# Altium project ie-track-kit-pwr-1.PrjPcb
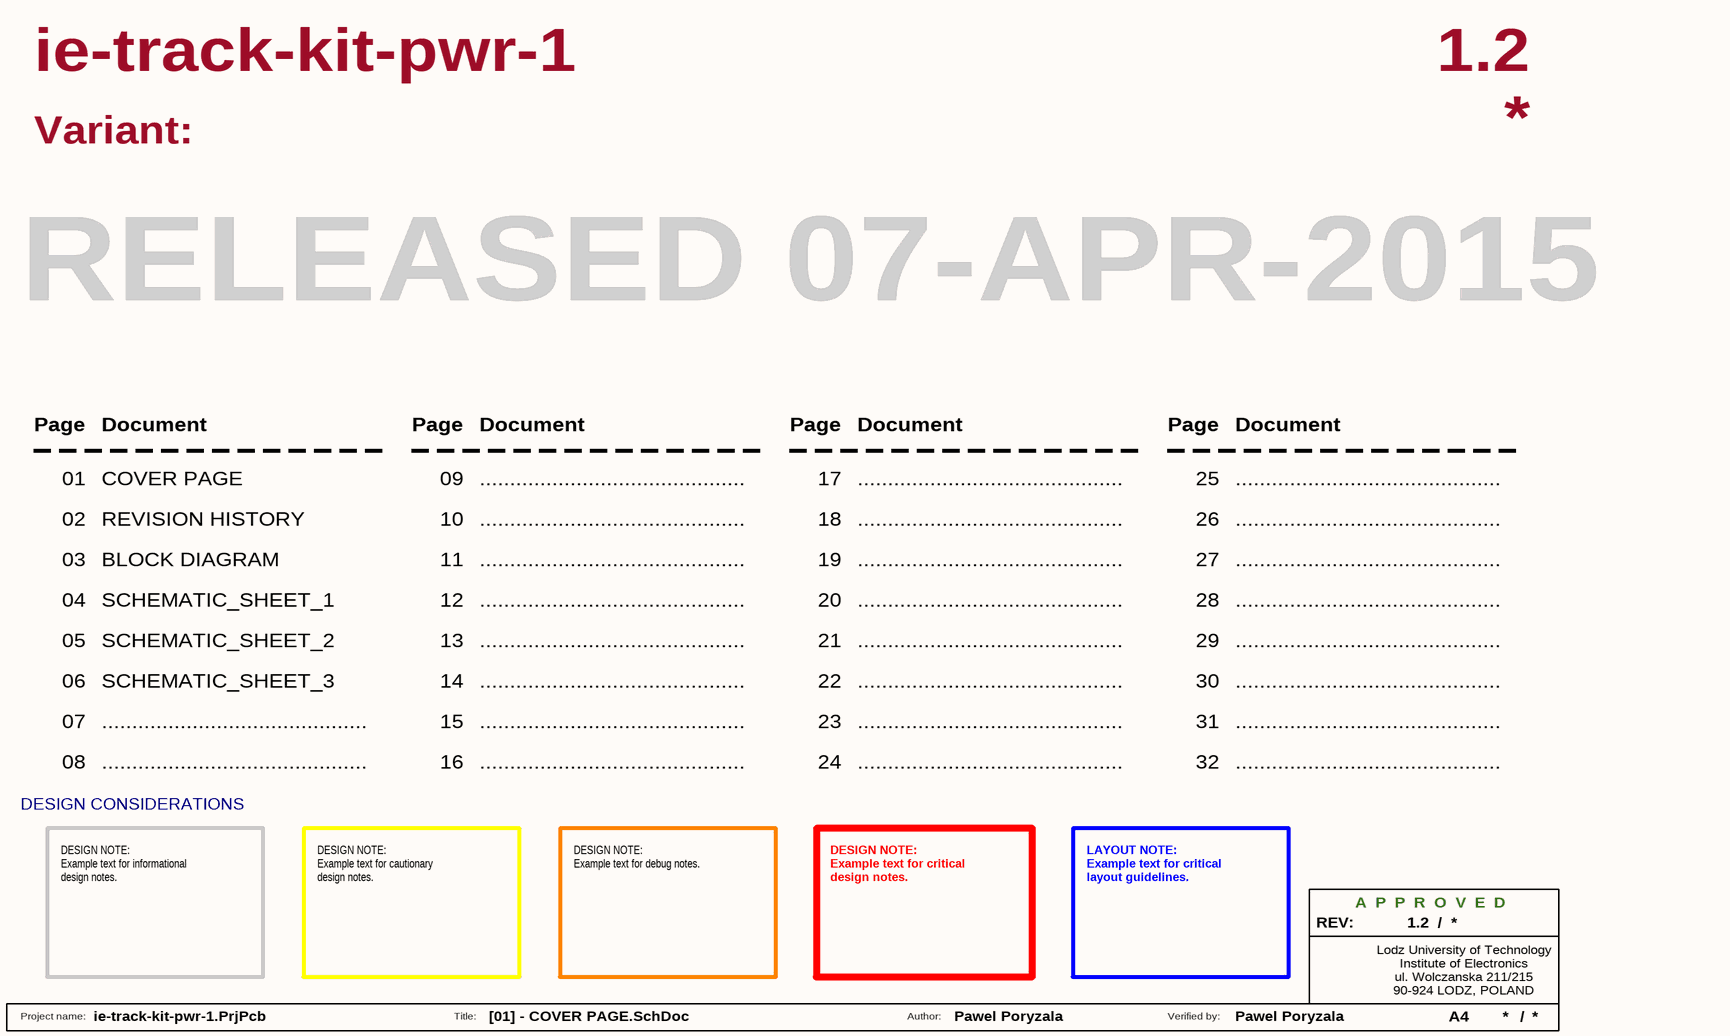
[diagram p0: [01] - COVER PAGE.SchDoc]
ProjectCheckedBy: Pawel Poryzala; ProjectDrawnBy: Pawel Poryzala; ProjectRevision: 1.2; ProjectSheetTotal: 5; ProjectTitle: ie-track-kit-pwr-1
8 sheets, 140 parts. Net scope: global (net labels, ports and power ports of the same name join across sheets).
Board file: ie-track-kit-pwr-1.PcbDoc
Sheets:
  [01] - COVER PAGE.SchDoc
  [02] - REVISION HISTORY.SchDoc
  [03] - BLOCK DIAGRAM.SchDoc
    Designator = [04] - BATTERIES WITH PROTECTION.SchDoc
    Designator = [05] - POWER.SchDoc
    Designator = [06] - MOTOR DRIVERS.SchDoc
    Designator = [07] - LIGHTS.SchDoc
    Designator = [08] - MAIN CONNECTOR.SchDoc

## Sheet [01] - COVER PAGE.SchDoc: Test title
size A4; Projectnumber: OWN-000; Project name:: Test name; Client: DSG; Date: YYYY-MM-DD; CheckedBy: Bartosz Kowierski; DrawnBy: Paweł Poryzała; Engineer: X; Revision: 0.9; Size: A4; Contact: datasystem.pl

### Notes on the sheet
- Variant:
- RELEASED 07-APR-2015
- Page
- Document
- 01
- COVER PAGE
- 09
- ............................................
- 17
- 25
- 02
- 03
- REVISION HISTORY
- BLOCK DIAGRAM
- 10
- 11
- 18
- 19
- 26
- 27
- 04
- 05
- SCHEMATIC_SHEET_1
- SCHEMATIC_SHEET_2
- 12
- 13
- 20
- 21
- 28
- 29
- 06
- SCHEMATIC_SHEET_3
- 14
- 22
- 30
- 07
- 08
- 15
- 16
- 23
- 24
- 31
- 32
- DESIGN CONSIDERATIONS
- DESIGN NOTE:
  Example text for informational
  design notes.
- DESIGN NOTE:
  Example text for cautionary
  design notes.
- DESIGN NOTE:
  Example text for debug notes.
- DESIGN NOTE:
  Example text for critical
  design notes.
- LAYOUT NOTE:
  Example text for critical
  layout guidelines.
- REV:
- A  P  P  R  O  V  E  D
- /
- Lodz University of Technology
- ul. Wolczanska 211/215
- 90-924 LODZ, POLAND
- Institute of Electronics
- Project name:
- Title:
- Author:
- Verified by:

## Sheet [02] - REVISION HISTORY.SchDoc: Test title
size A4; Project name:: Test name; Client: DSG; Date: YYYY-MM-DD; CheckedBy: Bartosz Kowierski; DrawnBy: Paweł Poryzała; Engineer: X; Revision: 0.9; Size: A4; Contact: datasystem.pl
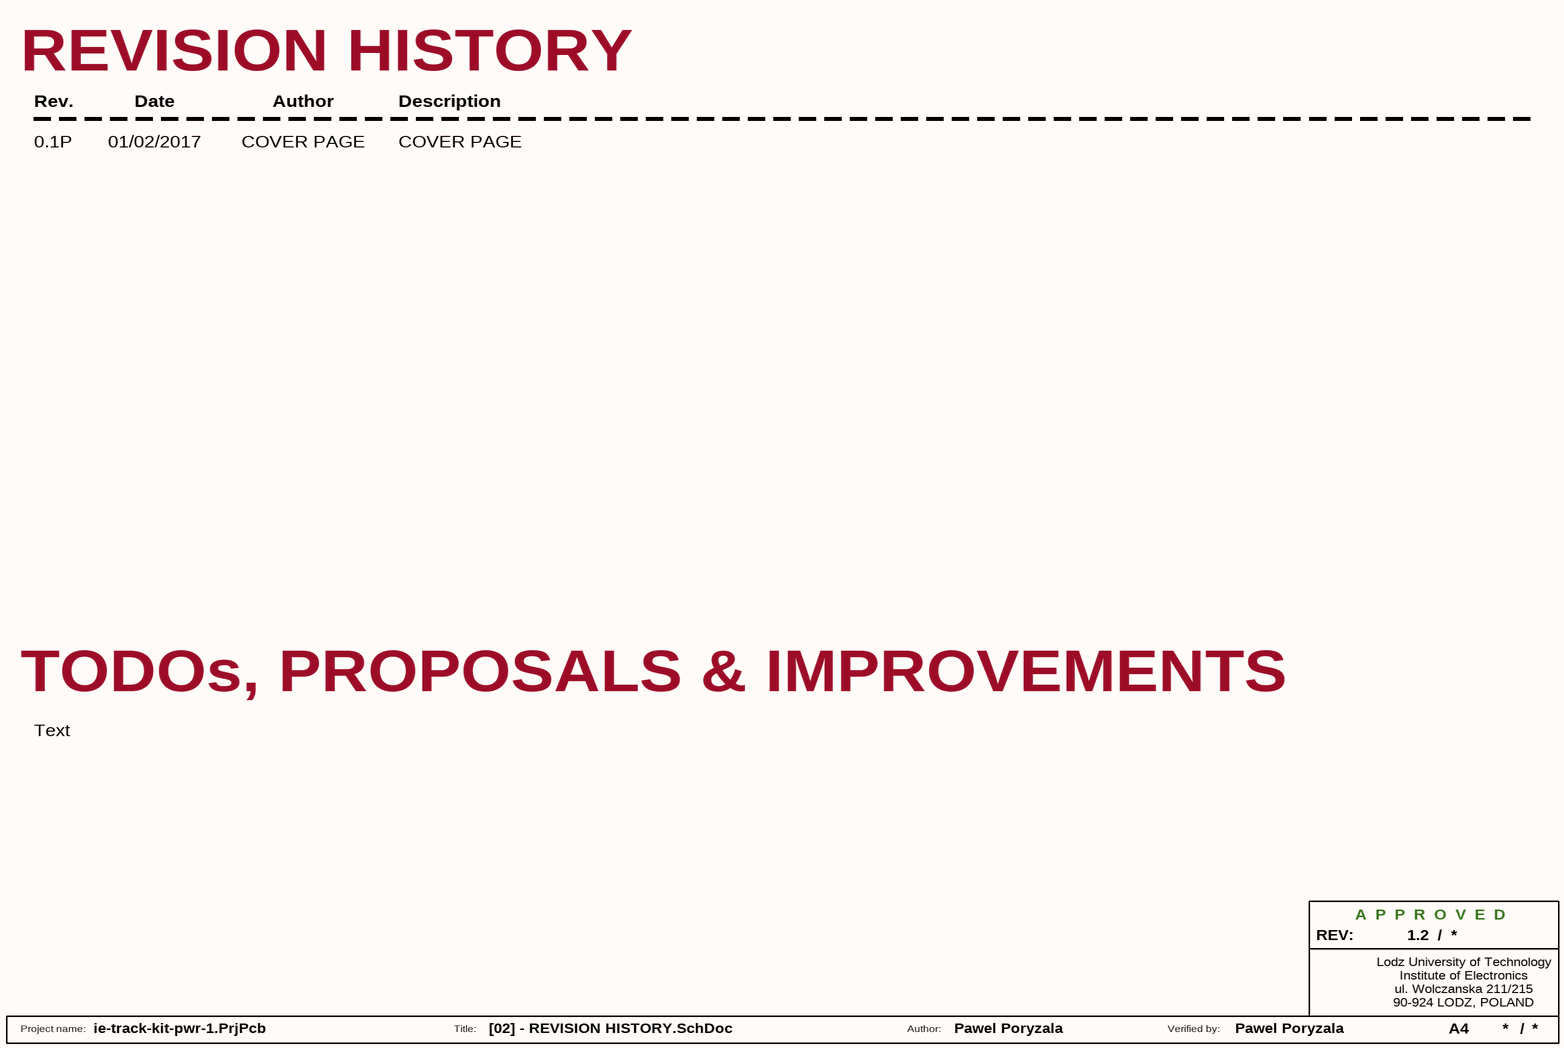
[diagram p1: [02] - REVISION HISTORY.SchDoc]

### Notes on the sheet
- REVISION HISTORY
- Rev.
- Date
- Author
- Description
- 0.1P
- 01/02/2017
- COVER PAGE
- TODOs, PROPOSALS & IMPROVEMENTS
- Text
- REV:
- A  P  P  R  O  V  E  D
- /
- Lodz University of Technology
- ul. Wolczanska 211/215
- 90-924 LODZ, POLAND
- Institute of Electronics
- Project name:
- Title:
- Author:
- Verified by:

## Sheet [03] - BLOCK DIAGRAM.SchDoc: Test title
size A4; PageSetup: Record=PageOptions|CenterHorizontal=True|CenterVertical=True|PrintScale=0.52|XCorrection=1.00|YCorrection=1.00|PrintKind=1|BorderSize=5000000|LeftOffset=0|BottomOffset=0|Orientation=2|PaperLength=1000|PaperWidth=1000|Scale=100|PaperSource=4|PrintQuality=600|MediaType=1|DitherType=10|PrintScaleMode=1|PaperKind=A4|PaperIndex=9; Projectnumber: OWN-000; Project name:: Test name; Client: DSG; Date: YYYY-MM-DD; CheckedBy: Bartosz Kowierski; DrawnBy: Paweł Poryzała; Engineer: X; Revision: 0.9; Size: A4; Contact: datasystem.pl
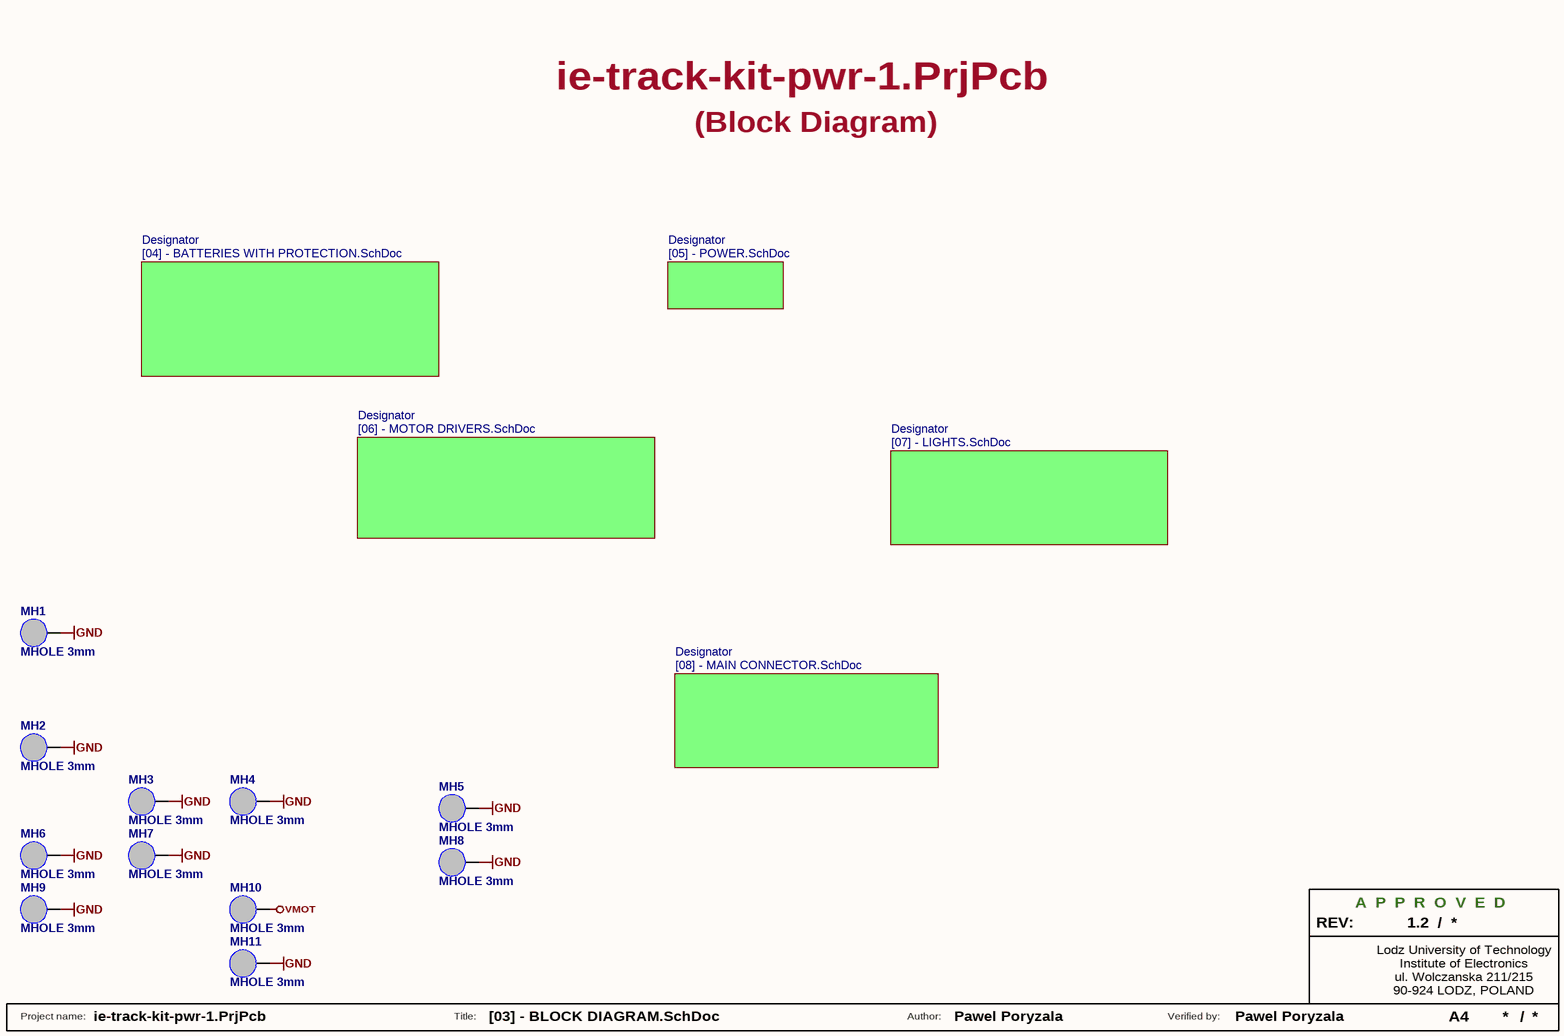
[diagram p2: [03] - BLOCK DIAGRAM.SchDoc]

### Parts
MH1  MHOLE 3mm  [3mm screw drill I]  (no BOM)
MH2  MHOLE 3mm  [3mm screw drill I]  (no BOM)
MH3  MHOLE 3mm  [3mm screw drill I]  (no BOM)
MH4  MHOLE 3mm  [3mm screw drill I]  (no BOM)
MH5  MHOLE 3mm  [3mm screw drill I]  (no BOM)
MH6  MHOLE 3mm  [3mm screw drill I]  (no BOM)
MH7  MHOLE 3mm  [3mm screw drill I]  (no BOM)
MH8  MHOLE 3mm  [3mm screw drill I]  (no BOM)
MH9  MHOLE 3mm  [3mm screw drill I]  (no BOM)
MH10  MHOLE 3mm  [3mm screw drill I]  (no BOM)
MH11  MHOLE 3mm  [3mm screw drill I]  (no BOM)

### Sub-sheets
Designator = [04] - BATTERIES WITH PROTECTION.SchDoc: no entries
Designator = [05] - POWER.SchDoc: no entries
Designator = [06] - MOTOR DRIVERS.SchDoc: no entries
Designator = [07] - LIGHTS.SchDoc: no entries
Designator = [08] - MAIN CONNECTOR.SchDoc: no entries

### Nets
GND: MH1.1(GND) MH2.1(GND) MH3.1(GND) MH4.1(GND) MH5.1(GND) MH6.1(GND) MH7.1(GND) MH8.1(GND) MH9.1(GND) MH11.1(GND)
VMOT: MH10.1(GND)

### Notes on the sheet
- (Block Diagram)
- REV:
- A  P  P  R  O  V  E  D
- /
- Lodz University of Technology
- ul. Wolczanska 211/215
- 90-924 LODZ, POLAND
- Institute of Electronics
- Project name:
- Title:
- Author:
- Verified by:

### Library data of the parts
MH1-MH11 = MHOLE_3MM: 3mm Mounting Hole

## Sheet [04] - BATTERIES WITH PROTECTION.SchDoc
size A4; Projectnumber: OWN-000; Size: A4; Contact: datasystem.pl
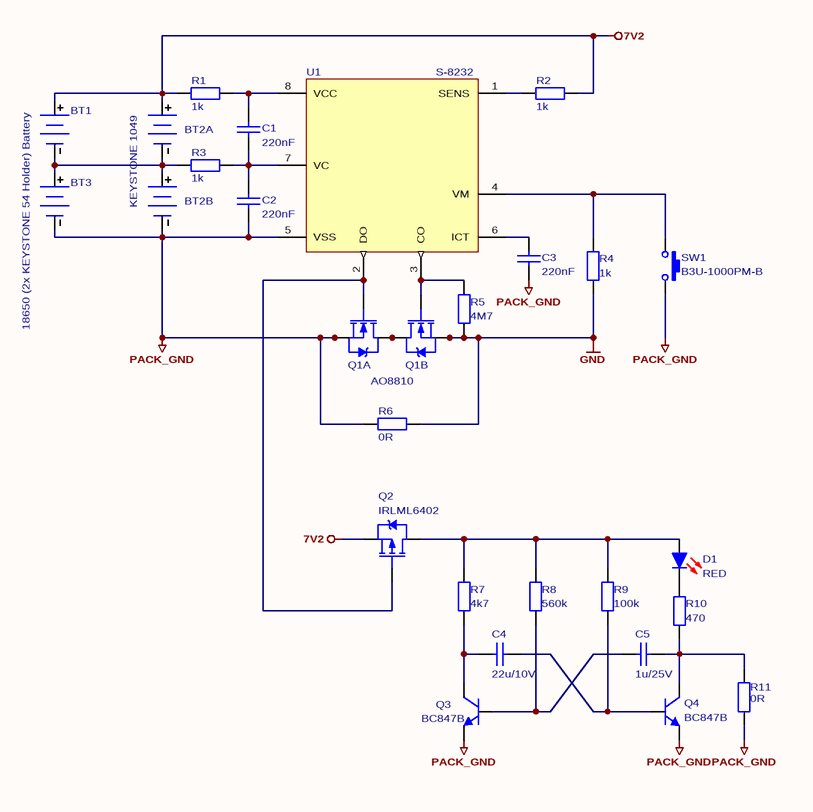
[diagram p3: [04] - BATTERIES WITH PROTECTION.SchDoc]

### Parts
BT1  18650 (2x KEYSTONE 54 Holder) Battery  [KEYSTONE_54_W_18650]  (value not drawn)
BT2  KEYSTONE 1049  [KEYSTONE_1049]  (parts A,B of 2)  (no BOM)
BT3  18650 (2x KEYSTONE 54 Holder) Battery  [KEYSTONE_54_W_18650]
C1  220nF  [C0805]
C2  220nF  [C0805]
C3  220nF  [C0805]
C4  22u/10V  [C0805]
C5  1u/25V  [C0805]
D1  RED  [LED0805R]
Q1  AO8810  [TSSOP8]  (parts A,B of 2)
Q2  IRLML6402  [SOT-23]
Q3  BC847B  [SOT-23]
Q4  BC847B  [SOT-23]
R1  1k  [R0805]
R2  1k  [R0805]
R3  1k  [R0805]
R4  1k  [R0805]
R5  4M7  [R0805]
R6  0R  [R0805]
R7  4k7  [R0805]
R8  560k  [R0805]
R9  100k  [R0805]
R10  470  [R0805]
R11  0R  [R0805]
SW1  B3U-1000PM-B  [B3U-1000PM-B]
U1  S-8232  [TSSOP8]

### Nets
7V2: BT1.1(+) BT2.1(+) Q2.2(S) R1.1 R2.2
GND: Q1.6(S2) Q1.7(S2) R4.2 R5.2 R6.1
PACK_GND: BT2.3(-) BT3.2(-) C2.1 C3.1 Q1.2(S1) Q1.3(S1) Q3.2(E) Q4.2(E) R6.2 R11.1 SW1.2 U1.5(VSS)
NetBT1_2: BT1.2(-) BT2.2(-) BT2.4(+) BT3.1(+) R3.1
NetC1_1: C1.1 C2.2 R3.2 U1.7(VC)
NetC1_2: C1.2 R1.2 U1.8(VCC)
NetC3_2: C3.2 U1.6(ICT)
NetC4_1: C4.1 Q3.3(C) R7.2
NetC4_2: C4.2 Q4.1(B) R9.2
NetC5_1: C5.1 Q3.1(B) R8.2
NetC5_2: C5.2 Q4.3(C) R10.2 R11.2
NetD1_1: D1.1(A) Q2.3(D) R7.1 R8.1 R9.1
NetD1_2: D1.2(K) R10.1
NetQ1_1: Q1.1(D1/D2) Q1.8(D1/D3)
NetQ1_4: Q1.4(G1) Q2.1(G) U1.2(DO)
NetQ1_5: Q1.5(G2) R5.1 U1.3(CO)
NetR2_1: R2.1 U1.1(SENS)
NetR4_1: R4.1 SW1.1 U1.4(VM)

### Notes on the sheet
- REV:
- A  P  P  R  O  V  E  D
- /
- Lodz University of Technology
- ul. Wolczanska 211/215
- 90-924 LODZ, POLAND
- Institute of Electronics
- Project name:
- Title:
- Author:
- Verified by:

### Library data of the parts
BT1 BT3 = 18650: Published: 24-Mar-1999; Revision: July-2002: Re-released for DXP Platform.; Publisher: Altium Limited
BT2 = Keystone 1049: 2x 18650 LiPo Acu in the KEYSTONE 1049 Holder; Published: 14-Sep-2006
C1-C5 = Cap: Capacitor; ComponentLink1Description: datasheet; ComponentLink2Description: supplier
  C1-C3: Value: 220nF
  C4: Value: 22u/10V
  C5: Value: 1u/25V
D1 = LED_RED: RED LED; Published: 04-Apr-2006
Q1 = AO8810: Dual Common Drain N-Channel MOSFET: Vds=20V, Rdson<20mR@4,5V, Id=7A; Published: 20-Mar-2006; Package Reference: TSOP6 (SOT23-6); Supplier 1: TME; Supplier Part Number 1: AO8810
Q2 = IRLML6402: P-Channel; -20V, -3.7A, 1.3W; HEXFET Power MOS-FET
Q3 Q4 = BC847B: NPN General Purpose Transistor (VCE=45V, IC=100mA, HFE=200-450); PowerRating: 250mW; VCEO: 45V; IC: 100mA; HFE: 200-450; Supplier 1: TME; Supplier 2: TME; Supplier 3: TME; Supplier 4: Farnell; Supplier 5: Farnell; Supplier 6: Farnell; Supplier 7: Farnell; Supplier 8: Farnell; Supplier 9: Farnell; Supplier Part Number 1: BC847B.215; Supplier Part Number 2: BC847B-DIO; Supplier Part Number 3: BC847B.235; Supplier Part Number 4: 1562449; Supplier Part Number 5: 1081232; Supplier Part Number 6: 1081232RL; Supplier Part Number 7: 1773608RL; Supplier Part Number 8: 2336781; Supplier Part Number 9: 1574343
R1-R11 = Res: Resistor; Published: 19-Feb-2006; ComponentLink1Description: datasheet; ComponentLink2Description: supplier
  R1-R4: Value: 1k
  R5: Value: 4M7
  R6 R11: Value: 0R
  R7: Value: 4k7
  R8: Value: 560k
  R9: Value: 100k
  R10: Value: 470
SW1 = B3U-1000PM-B: OMRON Ultra-small Tactile Switch - 12V/50mA
U1 = S-8232: Battery Protection IC For 2-Serial-Cell Pack

## Sheet [05] - POWER.SchDoc
size A4; Projectnumber: OWN-000; Size: A4; Contact: datasystem.pl
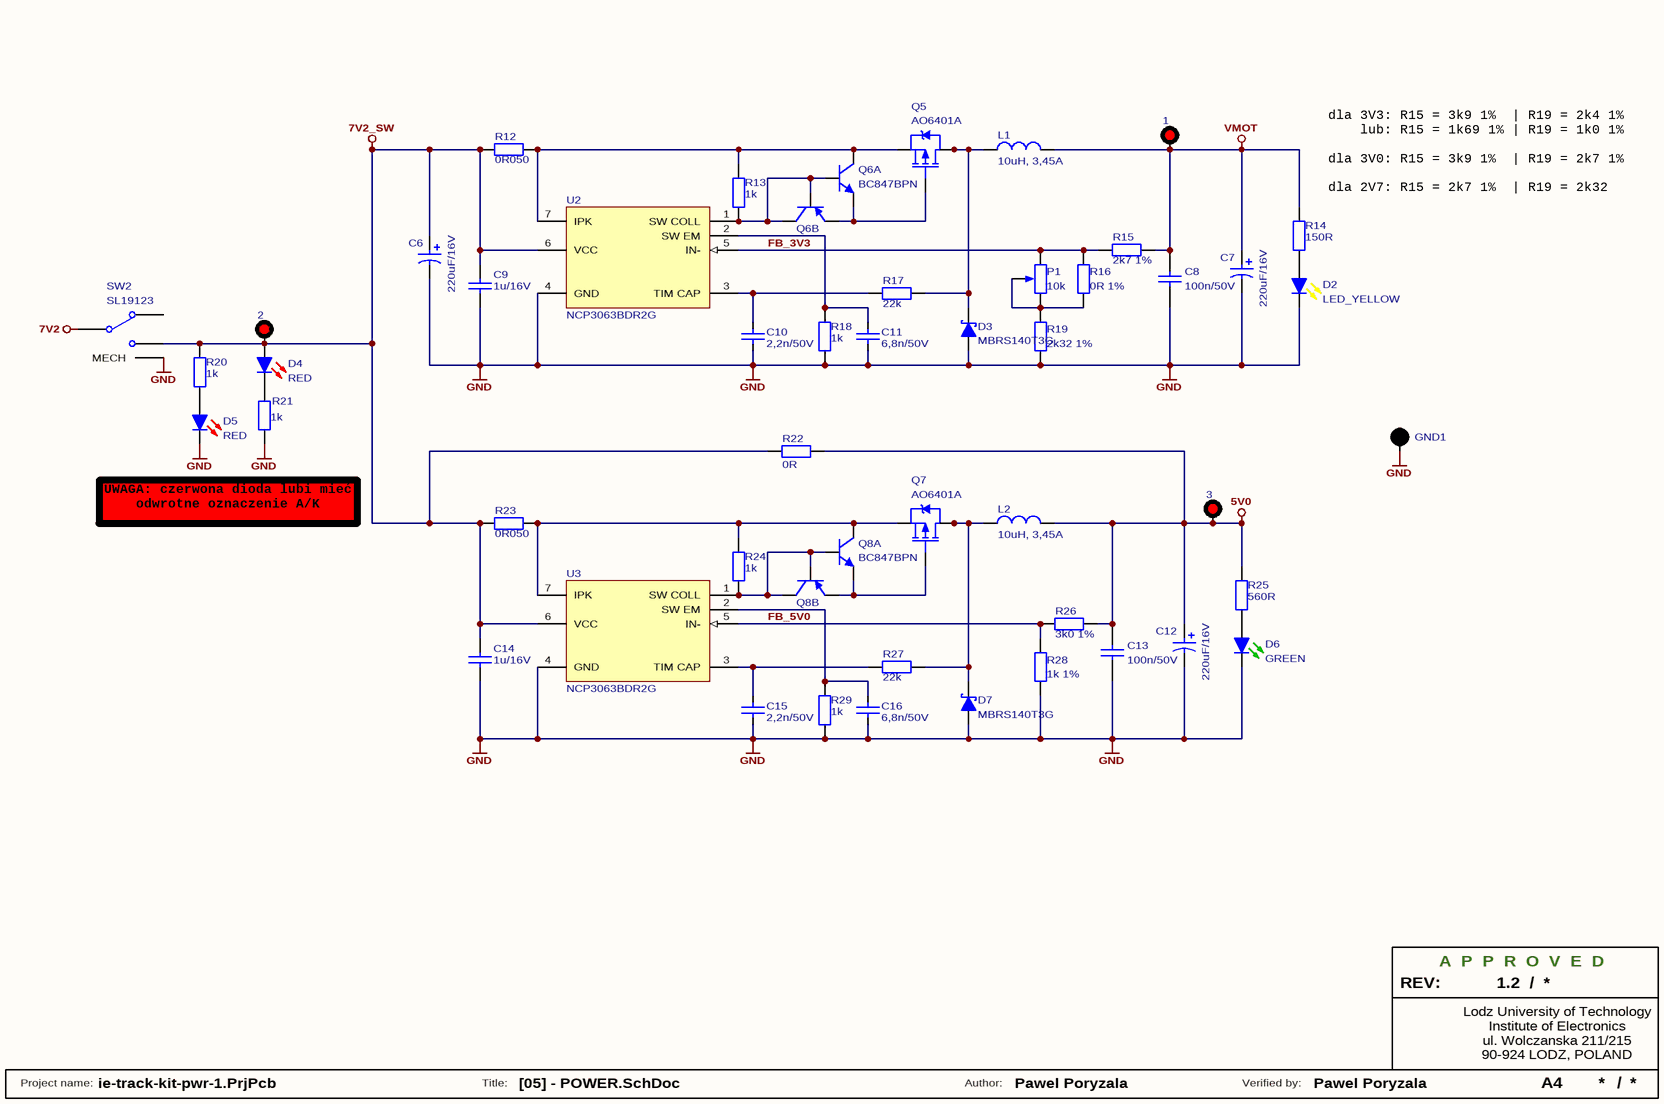
[diagram p4: [05] - POWER.SchDoc]

### Parts
1  Keystone 5000 Test Point (RED)  [Keystone_5000_RED]  (value not drawn)
2  Keystone 5000 Test Point (RED)  [Keystone_5000_RED]  (value not drawn)
3  Keystone 5000 Test Point (RED)  [Keystone_5000_RED]  (value not drawn)
C6  220uF/16V  [CES_E_8.3x8.3_6.2]
C7  220uF/16V  [CES_E_8.3x8.3_6.2]
C8  100n/50V  [C0805]
C9  1u/16V  [C0805]
C10  2,2n/50V  [C0805]
C11  6,8n/50V  [C0805]
C12  220uF/16V  [CES_E_8.3x8.3_6.2]
C13  100n/50V  [C0805]
C14  1u/16V  [C0805]
C15  2,2n/50V  [C0805]
C16  6,8n/50V  [C0805]
D2  LED_YELLOW  [LED0805Y]
D3  MBRS140T3G  [SMB]
D4  RED  [LED0805R]
D5  RED  [LED0805R]
D6  GREEN  [LED0805G]
D7  MBRS140T3G  [SMB]
GND1  Keystone 5001 Test Point (BLACK)  [Keystone_5001_BLACK]  (value not drawn)
L1  10uH, 3,45A  [PSDB1005]
L2  10uH, 3,45A  [PSDB1005]
P1  10k  [3364W]
Q5  AO6401A  [SOT-23-6]
Q6  BC847BPN  [SOT-323-6 (SOT-363, SC88, SC70-6)]  (parts A,B of 2)
Q7  AO6401A  [SOT-23-6]
Q8  BC847BPN  [SOT-323-6 (SOT-363, SC88, SC70-6)]  (parts A,B of 2)
R12  0R050  [R0805]
R13  1k  [R0805]
R14  150R  [R0805]
R15  2k7 1%  [R0805]
R16  0R 1%  [R0805]
R17  22k  [R0805]
R18  1k  [R0805]
R19  2k32 1%  [R0805]
R20  1k  [R0805]
R21  1k  [R0805]
R22  0R  [R1206]
R23  0R050  [R0805]
R24  1k  [R0805]
R25  560R  [R0805]
R26  3k0 1%  [R0805]
R27  22k  [R0805]
R28  1k 1%  [R0805]
R29  1k  [R0805]
SW2  SL19123  [500SSPxS1M6xEA]
U2  NCP3063BDR2G  [SO8]
U3  NCP3063BDR2G  [SO8]

### Nets
5V0: 3.0 C12.1 C13.2 L2.2 R22.2 R25.1 R26.2
7V2: SW2.2
7V2_SW: 2.0 C6.1 C9.2 C14.2 D4.1(A) R12.1 R20.1 R22.1 R23.1 SW2.3 U2.6(VCC) U3.6(VCC)
GND: C6.2 C7.2 C8.1 C9.1 C10.1 C11.1 C12.2 C13.1 C14.1 C15.1 C16.1 D2.2(K) D3.1(A) D5.2(K) D6.2(K) D7.1(A) GND1.0 R18.2 R19.2 R21.2 R28.2 R29.2 SW2.M(MECH) U2.4(GND) U3.4(GND)
VMOT: 1.0 C7.1 C8.2 L1.2 R14.1 R15.2
FB_3V3: P1.1(TOP) R15.1 R16.1 U2.5(IN-)
FB_5V0: R26.1 R28.1 U3.5(IN-)
NetC10_2: C10.2 R17.2 U2.3(TIM_CAP)
NetC11_2: C11.2 R18.1 U2.2(SW_EM)
NetC15_2: C15.2 R27.2 U3.3(TIM_CAP)
NetC16_2: C16.2 R29.1 U3.2(SW_EM)
NetD2_1: D2.1(A) R14.2
NetD3_2: D3.2(K) L1.1 Q5.1(D) Q5.2(D) Q5.5(D) Q5.6(D) R17.1
NetD4_2: D4.2(K) R21.1
NetD5_1: D5.1(A) R20.2
NetD6_1: D6.1(A) R25.2
NetD7_2: D7.2(K) L2.1 Q7.1(D) Q7.2(D) Q7.5(D) Q7.6(D) R27.1
NetP1_2: P1.2(BOT) P1.3(TAP) R16.2 R19.1
NetQ5_3: Q5.3(G) Q6.1(EA) Q6.4(EB)
NetQ5_4: Q5.4(S) Q6.6(CA) R12.2 R13.1 U2.7(IPK)
NetQ6_2: Q6.2(BA) Q6.3(CB) Q6.5(BB) R13.2 U2.1(SW_COLL)
NetQ7_3: Q7.3(G) Q8.1(EA) Q8.4(EB)
NetQ7_4: Q7.4(S) Q8.6(CA) R23.2 R24.1 U3.7(IPK)
NetQ8_2: Q8.2(BA) Q8.3(CB) Q8.5(BB) R24.2 U3.1(SW_COLL)

Not connected (* = marked no-connect by the designer): SW2 1

### Notes on the sheet
- (near R14) dla 3V3: R15 = 3k9 1%  | R19 = 2k4 1%
  lub: R15 = 1k69 1% | R19 = 1k0 1%
  dla 3V0: R15 = 3k9 1%  | R19 = 2k7 1%
  dla 2V7: R15 = 2k7 1%  | R19 = 2k32 1%
- UWAGA: czerwona dioda lubi mieć odwrotne oznaczenie A/K
- REV:
- A  P  P  R  O  V  E  D
- /
- Lodz University of Technology
- ul. Wolczanska 211/215
- 90-924 LODZ, POLAND
- Institute of Electronics
- Project name:
- Title:
- Author:
- Verified by:

### Library data of the parts
1-3 = Keystone 5000 Test Point
C6 C7 C12 = Cap Pol: Polarized Capacitor; ComponentLink1Description: datasheet; ComponentLink2Description: supplier; Value: 220uF/16V
C8-C11 C13-C16 = Cap: Capacitor; ComponentLink1Description: datasheet; ComponentLink2Description: supplier
  C8 C13: Value: 100n/50V
  C9 C14: Value: 1u/16V
  C10 C15: Value: 2,2n/50V
  C11 C16: Value: 6,8n/50V
D2 = LED_YELLOW: YELLOW LED; Published: 04-Apr-2006
D3 D7 = MBRS140T3G: Schottky barrier rectifier: 40V, 1A; Published: 22-Nov-2006; PackageReference: SMB; Supplier 1: TME; Supplier 2: Farnell; Supplier Part Number 1: MBRS140T3G; Supplier Part Number 2: 1467526
D4 D5 = LED_RED: RED LED; Published: 04-Apr-2006
D6 = LED_GREEN: GREEN LED; Published: 04-Apr-2006
GND1 = Keystone 5001 Test Point
L1 L2 = PSDB1005NT100: 10uH, 20%, 3,45A, PSDB1005N Series Inductor; Published: 08-Mar-2006; ComponentLink1Description: datasheet; ComponentLink2Description: supplier; Supplier 1: TME; Supplier Part Number 1: PSDB1005NT100; Value: 10uH, 3,45A
P1 = 3364W-1-103E: Published: 21-10-2009; ComponentLink1Description: datasheet; ComponentLink2Description: supplier; Value: 10k
Q5 Q7 = AO6401A: P-Channel MOSFET; -60V, -5A, 1.3W;; Supplier 1: TME; Supplier Part Number 1: AO6401A
Q6 Q8 = BC847BPN: PNP/NPN General Purpose Transistor (VCE=45V, IC=100mA); Supplier 1: TME; Supplier 2: Farnell; Supplier 3: Farnell; Supplier 4: Farnell; Supplier Part Number 1: BC847BPN.115; Supplier Part Number 2: 2336824; Supplier Part Number 3: 1081233RL; Supplier Part Number 4: 1081233
R12-R29 = Res: Resistor; Published: 19-Feb-2006; ComponentLink1Description: datasheet; ComponentLink2Description: supplier
  R12 R23: Value: 0R050
  R13 R18 R20 R21 R24 R29: Value: 1k
  R14: Value: 150R
  R15: Value: 2k7 1%
  R16: Value: 0R 1%
  R17 R27: Value: 22k
  R19: Value: 2k32 1%
  R22: Value: 0R
  R25: Value: 560R
  R26: Value: 3k0 1%
  R28: Value: 1k 1%
SW2 = SL19123: Canal Electronic SPDT AC: 3A/250V, DC: 6A/28V; Supplier 1: TME; Supplier Part Number 1: SL19123
U2 U3 = NCP3063BDR2G: DC-DC Converter NCP3063BDR2G (Farnell 1547126); Published: 22-Nov-2006; PackageReference: SO8; Supplier 1: Farnell; Supplier 2: Farnell; Supplier 3: Farnell; Supplier Part Number 1: 1547126; Supplier Part Number 2: 2126136; Supplier Part Number 3: 1547126RL

## Sheet [06] - MOTOR DRIVERS.SchDoc: X
size A4; Date: DD-MM-YYYY; CheckedBy: X; DrawnBy: Y; Revision: 0.0.0; SheetNumber: X; SheetTotal: Y; Projectnumber: OWN-000; Size: A4; Contact: datasystem.pl; Projectname: X
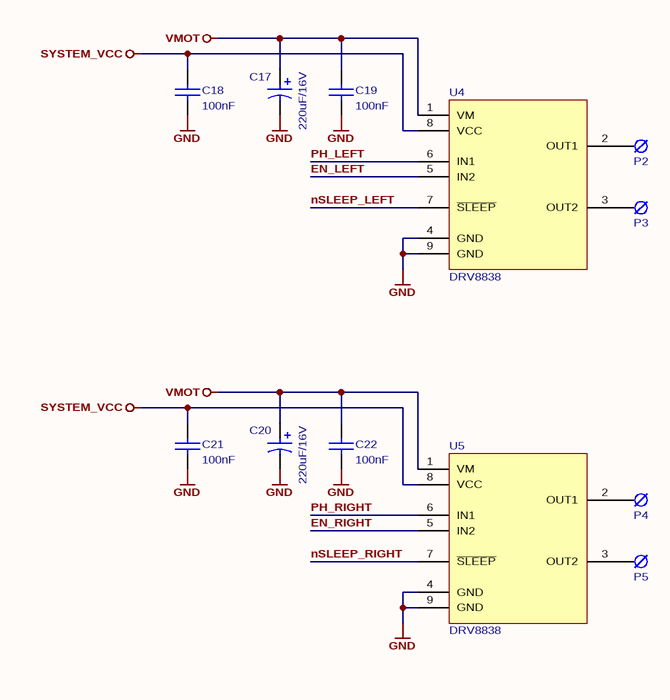
[diagram p5: [06] - MOTOR DRIVERS.SchDoc]

### Parts
C17  220uF/16V  [CES_E_8.3x8.3_6.2]
C18  100nF  [C0805]
C19  100nF  [C0805]
C20  220uF/16V  [CES_E_8.3x8.3_6.2]
C21  100nF  [C0805]
C22  100nF  [C0805]
P2  CablePAD  [PADTHT1.5x3mm]  (value not drawn)  (no BOM)
P3  CablePAD  [PADTHT1.5x3mm]  (value not drawn)  (no BOM)
P4  CablePAD  [PADTHT1.5x3mm]  (value not drawn)  (no BOM)
P5  CablePAD  [PADTHT1.5x3mm]  (value not drawn)  (no BOM)
U4  DRV8838  [WSON8 (DSG8-1600X900TP)]
U5  DRV8838  [WSON8 (DSG8-1600X900TP)]

### Nets
GND: C17.2 C18.1 C19.1 C20.2 C21.1 C22.1 U4.4(GND) U4.9(GND) U5.4(GND) U5.9(GND)
SYSTEM_VCC: C18.2 C21.2 U4.8(VCC) U5.8(VCC)
VMOT: C17.1 C19.2 C20.1 C22.2 U4.1(VM) U5.1(VM)
EN_LEFT: U4.5(IN2)
EN_RIGHT: U5.5(IN2)
nSLEEP_LEFT: U4.7(~{SLEEP})
nSLEEP_RIGHT: U5.7(~{SLEEP})
PH_LEFT: U4.6(IN1)
PH_RIGHT: U5.6(IN1)
NetP2_0: P2.0 U4.2(OUT1)
NetP3_0: P3.0 U4.3(OUT2)
NetP4_0: P4.0 U5.2(OUT1)
NetP5_0: P5.0 U5.3(OUT2)

### Notes on the sheet
- REV:
- A  P  P  R  O  V  E  D
- /
- Lodz University of Technology
- ul. Wolczanska 211/215
- 90-924 LODZ, POLAND
- Institute of Electronics
- Project name:
- Title:
- Author:
- Verified by:

### Library data of the parts
C17 C20 = Cap Pol: Polarized Capacitor; ComponentLink1Description: datasheet; ComponentLink2Description: supplier; Value: 220uF/16V
C18 C19 C21 C22 = Cap: Capacitor; ComponentLink1Description: datasheet; ComponentLink2Description: supplier; Value: 100nF
P2-P5 = CablePAD: Cable/Wire Soldering PAD; Published: 14-Sep-2006
U4 U5 = DRV8838: Low-Voltage H-Bridge Driver; Published: 14-Sep-2006; Supplier 1: Farnell; Supplier 2: Farnell; Supplier Part Number 1: 2420232; Supplier Part Number 2: 2542736

## Sheet [07] - LIGHTS.SchDoc: X
size A4; Date: DD-MM-YYYY; CheckedBy: X; DrawnBy: Y; Revision: 0.0.0; SheetNumber: X; SheetTotal: Y; Projectnumber: OWN-000; Size: A4; Contact: datasystem.pl; Projectname: X
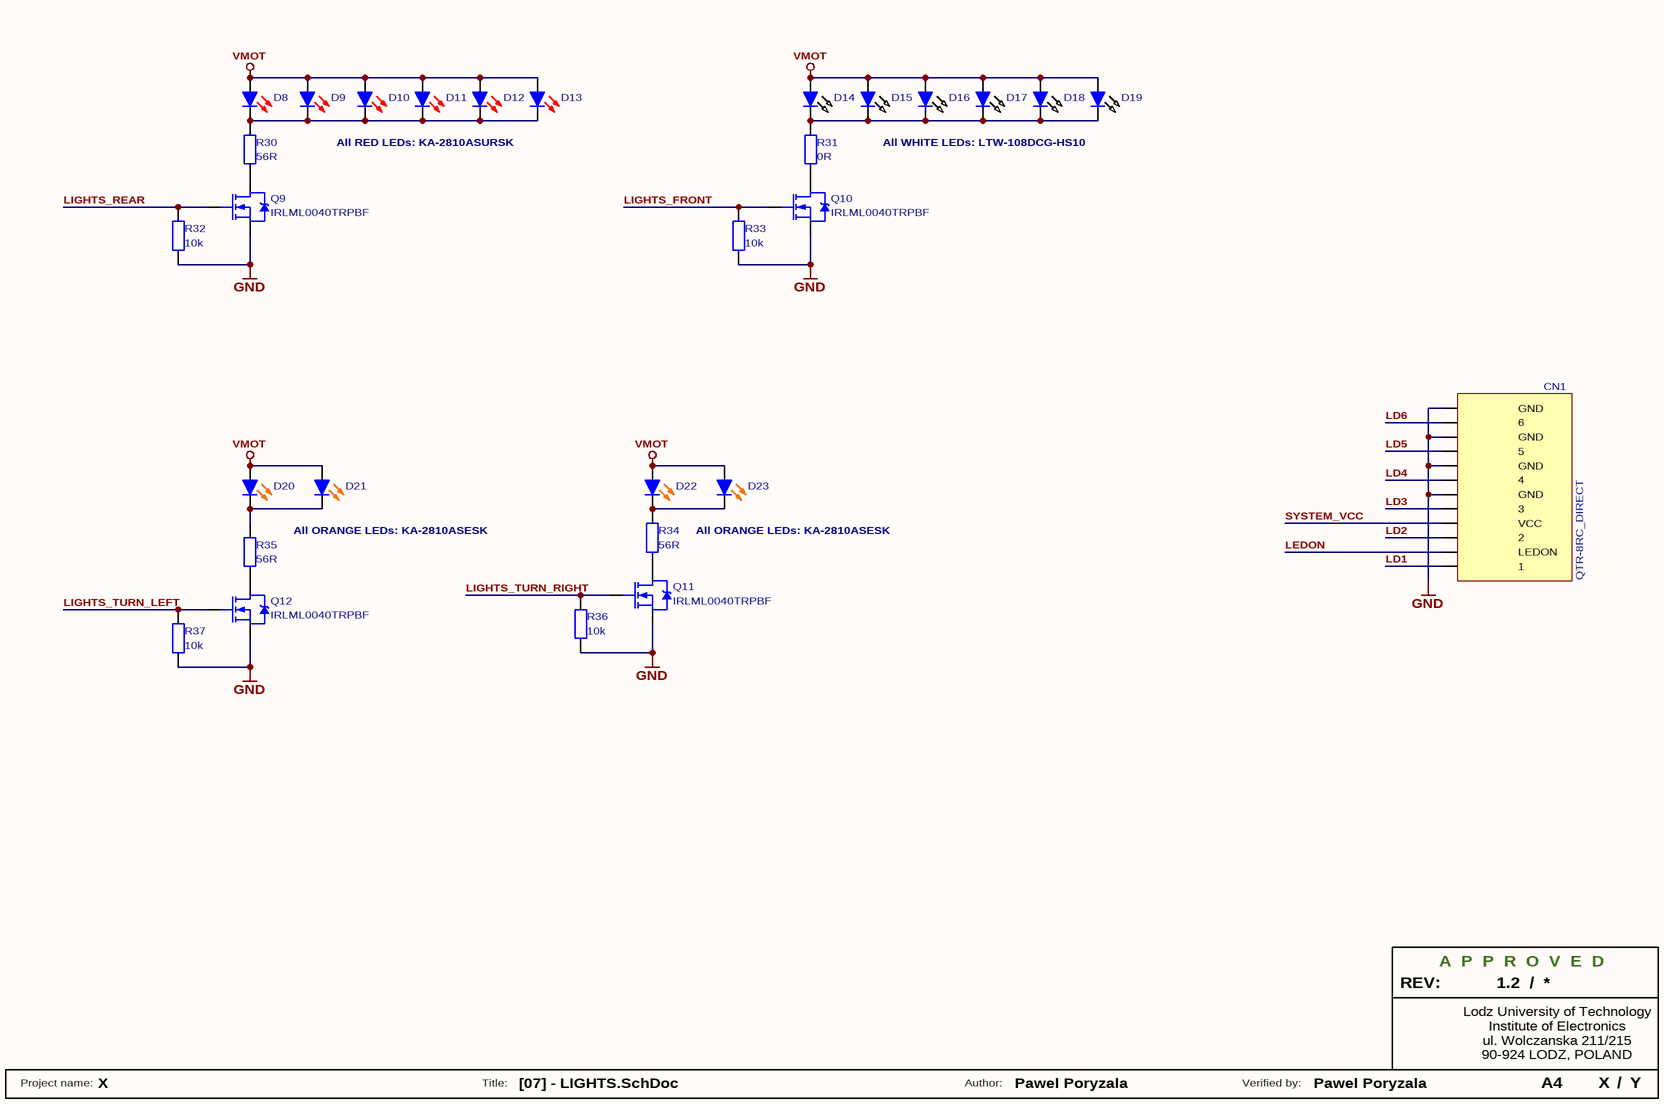
[diagram p6: [07] - LIGHTS.SchDoc]

### Parts
CN1  QTR-8RC_DIRECT  [QTR-8RC_SNAPPED_GOLDPIN_VERTICAL]
D8  KA-2810ASURSK  [LED2810]  (value not drawn)
D9  KA-2810ASURSK  [LED2810]  (value not drawn)
D10  KA-2810ASURSK  [LED2810]  (value not drawn)
D11  KA-2810ASURSK  [LED2810]  (value not drawn)
D12  KA-2810ASURSK  [LED2810]  (value not drawn)
D13  KA-2810ASURSK  [LED2810]  (value not drawn)
D14  LTW-108DCG-HS10  [LED2810]  (value not drawn)
D15  LTW-108DCG-HS10  [LED2810]  (value not drawn)
D16  LTW-108DCG-HS10  [LED2810]  (value not drawn)
D17  LTW-108DCG-HS10  [LED2810]  (value not drawn)
D18  LTW-108DCG-HS10  [LED2810]  (value not drawn)
D19  LTW-108DCG-HS10  [LED2810]  (value not drawn)
D20  KA-2810ASESK  [LED2810]  (value not drawn)
D21  KA-2810ASESK  [LED2810]  (value not drawn)
D22  KA-2810ASESK  [LED2810]  (value not drawn)
D23  KA-2810ASESK  [LED2810]  (value not drawn)
Q9  IRLML0040TRPBF  [SOT-23]
Q10  IRLML0040TRPBF  [SOT-23]
Q11  IRLML0040TRPBF  [SOT-23]
Q12  IRLML0040TRPBF  [SOT-23]
R30  56R  [R0805]
R31  0R  [R0805]
R32  10k  [R0805]
R33  10k  [R0805]
R34  56R  [R0805]
R35  56R  [R0805]
R36  10k  [R0805]
R37  10k  [R0805]

### Nets
GND: CN1.GND Q9.2(S) Q10.2(S) Q11.2(S) Q12.2(S) R32.2 R33.2 R36.2 R37.2
SYSTEM_VCC: CN1.VCC
VMOT: D8.2(A) D9.2(A) D10.2(A) D11.2(A) D12.2(A) D13.2(A) D14.2(A) D15.2(A) D16.2(A) D17.2(A) D18.2(A) D19.2(A) D20.2(A) D21.2(A) D22.2(A) D23.2(A)
LD1: CN1.1
LD2: CN1.2
LD3: CN1.3
LD4: CN1.4
LD5: CN1.5
LD6: CN1.6
LEDON: CN1.LEDON
LIGHTS_FRONT: Q10.1(G) R33.1
LIGHTS_REAR: Q9.1(G) R32.1
LIGHTS_TURN_LEFT: Q12.1(G) R37.1
LIGHTS_TURN_RIGHT: Q11.1(G) R36.1
NetD8_1: D8.1(K) D9.1(K) D10.1(K) D11.1(K) D12.1(K) D13.1(K) R30.1
NetD14_1: D14.1(K) D15.1(K) D16.1(K) D17.1(K) D18.1(K) D19.1(K) R31.1
NetD20_1: D20.1(K) D21.1(K) R35.1
NetD22_1: D22.1(K) D23.1(K) R34.1
NetQ9_3: Q9.3(D) R30.2
NetQ10_3: Q10.3(D) R31.2
NetQ11_3: Q11.3(D) R34.2
NetQ12_3: Q12.3(D) R35.2

### Notes on the sheet
- All RED LEDs: KA-2810ASURSK
- All WHITE LEDs: LTW-108DCG-HS10
- All ORANGE LEDs: KA-2810ASESK
- REV:
- A  P  P  R  O  V  E  D
- /
- Lodz University of Technology
- ul. Wolczanska 211/215
- 90-924 LODZ, POLAND
- Institute of Electronics
- Project name:
- Title:
- Author:
- Verified by:

### Library data of the parts
CN1 = QTR-8RC_DIRECT: QTR-8RC Reflectance Sensor Array (Pololu item No. 961); Published: 14-Sep-2006
Q9-Q12 = IRLML0040TRPBF: N-Channel; 40V, 3.6A, 1,25W; HEXFET Power MOS-FET; Supplier 1: Farnell; Supplier 2: TME; Supplier 3: Farnell; Supplier 4: Farnell; Supplier Part Number 1: 1831088RL; Supplier Part Number 2: IRLML0040TRPBF; Supplier Part Number 3: 1829136; Supplier Part Number 4: 1831088
R30-R37 = Res: Resistor; Published: 19-Feb-2006; ComponentLink1Description: datasheet; ComponentLink2Description: supplier
  R30 R34 R35: Value: 56R
  R31: Value: 0R
  R32 R33 R36 R37: Value: 10k
D8-D13 = KA-2810ASURSK: Published: 04-Apr-2006
D14-D19 = LTW-108DCG-HS10: Published: 04-Apr-2006
D20-D23 = KA-2810ASESK: Published: 04-Apr-2006

## Sheet [08] - MAIN CONNECTOR.SchDoc: X
size A4; Date: DD-MM-YYYY; CheckedBy: X; DrawnBy: Y; Revision: 0.0.0; SheetNumber: X; SheetTotal: Y; Projectnumber: OWN-000; Size: A4; Contact: datasystem.pl; Projectname: X
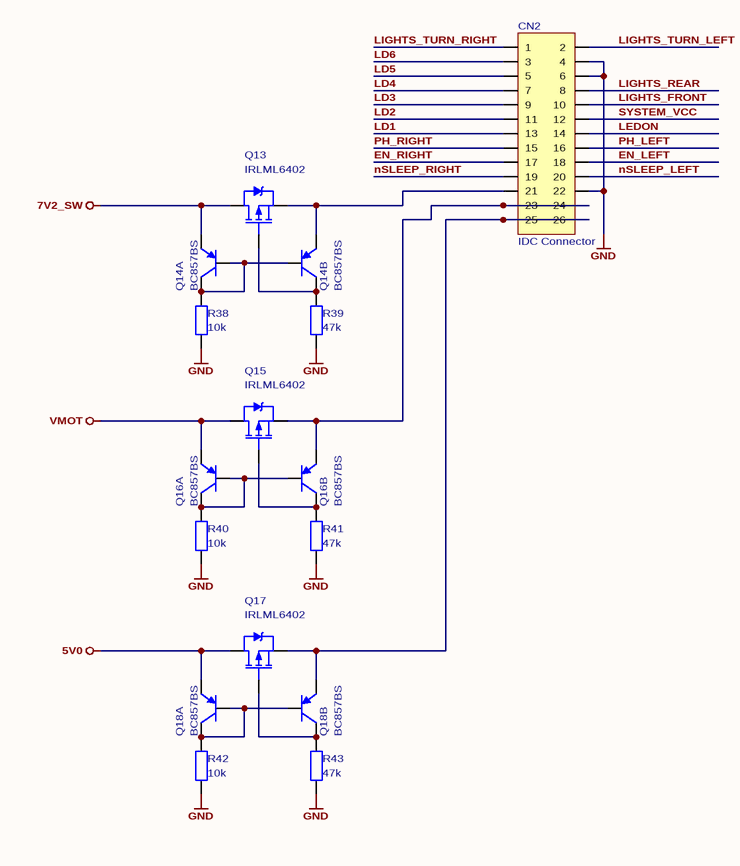
[diagram p7: [08] - MAIN CONNECTOR.SchDoc]

### Parts
CN2  IDC Connector  [IDC26_RA_LONG_W_CN]
Q13  IRLML6402  [SOT-23]
Q14  BC857BS  [SOT-323-6 (SOT-363, SC88, SC70-6)]  (parts A,B of 2)
Q15  IRLML6402  [SOT-23]
Q16  BC857BS  [SOT-323-6 (SOT-363, SC88, SC70-6)]  (parts A,B of 2)
Q17  IRLML6402  [SOT-23]
Q18  BC857BS  [SOT-323-6 (SOT-363, SC88, SC70-6)]  (parts A,B of 2)
R38  10k  [R0805]
R39  47k  [R0805]
R40  10k  [R0805]
R41  47k  [R0805]
R42  10k  [R0805]
R43  47k  [R0805]

### Nets
5V0: Q17.3(D) Q18.1(EA)
7V2_SW: Q13.3(D) Q14.1(EA)
GND: CN2.4 CN2.6 CN2.22 R38.1 R39.1 R40.1 R41.1 R42.1 R43.1
SYSTEM_VCC: CN2.12
VMOT: Q15.3(D) Q16.1(EA)
EN_LEFT: CN2.18
EN_RIGHT: CN2.17
LD1: CN2.13
LD2: CN2.11
LD3: CN2.9
LD4: CN2.7
LD5: CN2.5
LD6: CN2.3
LEDON: CN2.14
LIGHTS_FRONT: CN2.10
LIGHTS_REAR: CN2.8
LIGHTS_TURN_LEFT: CN2.2
LIGHTS_TURN_RIGHT: CN2.1
nSLEEP_LEFT: CN2.20
nSLEEP_RIGHT: CN2.19
PH_LEFT: CN2.16
PH_RIGHT: CN2.15
NetCN2_21: CN2.21 Q13.2(S) Q14.4(EB)
NetCN2_23: CN2.23 CN2.24 Q15.2(S) Q16.4(EB)
NetCN2_25: CN2.25 CN2.26 Q17.2(S) Q18.4(EB)
NetQ13_1: Q13.1(G) Q14.3(CB) R39.2
NetQ14_2: Q14.2(BA) Q14.5(BB) Q14.6(CA) R38.2
NetQ15_1: Q15.1(G) Q16.3(CB) R41.2
NetQ16_2: Q16.2(BA) Q16.5(BB) Q16.6(CA) R40.2
NetQ17_1: Q17.1(G) Q18.3(CB) R43.2
NetQ18_2: Q18.2(BA) Q18.5(BB) Q18.6(CA) R42.2

### Notes on the sheet
- REV:
- A  P  P  R  O  V  E  D
- /
- Lodz University of Technology
- ul. Wolczanska 211/215
- 90-924 LODZ, POLAND
- Institute of Electronics
- Project name:
- Title:
- Author:
- Verified by:

### Library data of the parts
CN2 = CN_13x2
Q13 Q15 Q17 = IRLML6402: as Q2 on sheet [04] - BATTERIES WITH PROTECTION
Q14 Q16 Q18 = BC857BS: 2xPNP General Purpose Transistor (VCE=-45V, IC=-100mA)
R38-R43 = Res: Resistor; Published: 19-Feb-2006; ComponentLink1Description: datasheet; ComponentLink2Description: supplier
  R38 R40 R42: Value: 10k
  R39 R41 R43: Value: 47k

## Nets that join several sheets
5V0: [05] - POWER (7 pins), [08] - MAIN CONNECTOR (Q17.3 Q18.1)
7V2: [04] - BATTERIES WITH PROTECTION (5 pins), [05] - POWER (SW2.2)
7V2_SW: [05] - POWER (12 pins), [08] - MAIN CONNECTOR (Q13.3 Q14.1)
GND: [03] - BLOCK DIAGRAM (10 pins), [04] - BATTERIES WITH PROTECTION (5 pins), [05] - POWER (25 pins), [06] - MOTOR DRIVERS (10 pins), [07] - LIGHTS (9 pins), [08] - MAIN CONNECTOR (9 pins)
SYSTEM_VCC: [06] - MOTOR DRIVERS (C18.2 C21.2 U4.8 U5.8), [07] - LIGHTS (CN1.VCC), [08] - MAIN CONNECTOR (CN2.12)
VMOT: [03] - BLOCK DIAGRAM (MH10.1), [05] - POWER (6 pins), [06] - MOTOR DRIVERS (6 pins), [07] - LIGHTS (16 pins), [08] - MAIN CONNECTOR (Q15.3 Q16.1)
EN_LEFT: [06] - MOTOR DRIVERS (U4.5), [08] - MAIN CONNECTOR (CN2.18)
EN_RIGHT: [06] - MOTOR DRIVERS (U5.5), [08] - MAIN CONNECTOR (CN2.17)
LD1: [07] - LIGHTS (CN1.1), [08] - MAIN CONNECTOR (CN2.13)
LD2: [07] - LIGHTS (CN1.2), [08] - MAIN CONNECTOR (CN2.11)
LD3: [07] - LIGHTS (CN1.3), [08] - MAIN CONNECTOR (CN2.9)
LD4: [07] - LIGHTS (CN1.4), [08] - MAIN CONNECTOR (CN2.7)
LD5: [07] - LIGHTS (CN1.5), [08] - MAIN CONNECTOR (CN2.5)
LD6: [07] - LIGHTS (CN1.6), [08] - MAIN CONNECTOR (CN2.3)
LEDON: [07] - LIGHTS (CN1.LEDON), [08] - MAIN CONNECTOR (CN2.14)
LIGHTS_FRONT: [07] - LIGHTS (Q10.1 R33.1), [08] - MAIN CONNECTOR (CN2.10)
LIGHTS_REAR: [07] - LIGHTS (Q9.1 R32.1), [08] - MAIN CONNECTOR (CN2.8)
LIGHTS_TURN_LEFT: [07] - LIGHTS (Q12.1 R37.1), [08] - MAIN CONNECTOR (CN2.2)
LIGHTS_TURN_RIGHT: [07] - LIGHTS (Q11.1 R36.1), [08] - MAIN CONNECTOR (CN2.1)
nSLEEP_LEFT: [06] - MOTOR DRIVERS (U4.7), [08] - MAIN CONNECTOR (CN2.20)
nSLEEP_RIGHT: [06] - MOTOR DRIVERS (U5.7), [08] - MAIN CONNECTOR (CN2.19)
PH_LEFT: [06] - MOTOR DRIVERS (U4.6), [08] - MAIN CONNECTOR (CN2.16)
PH_RIGHT: [06] - MOTOR DRIVERS (U5.6), [08] - MAIN CONNECTOR (CN2.15)

## Assembly variants
full: not fitted BT1 BT3 R16
simple: not fitted BT2 C1 C2 C3 C4 C5 D1 P1 Q1 Q2 Q3 R1 R2 R3 R4 R5 R7 R8 R9 R10 SW1 U1